# Altium schematic sheet STM32H745 - Copy.SchDoc
size A
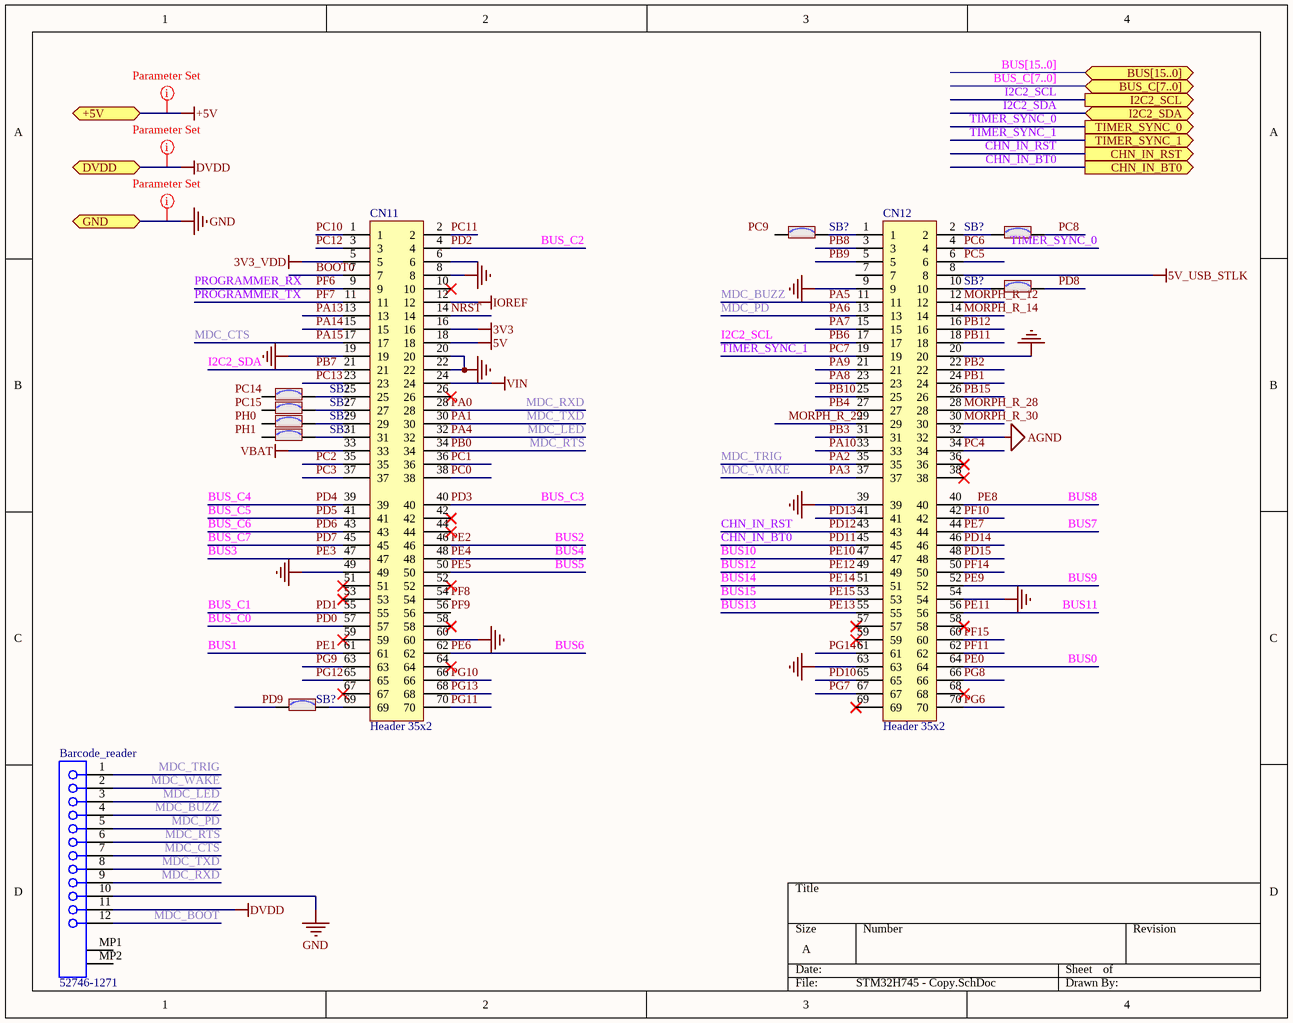
[diagram p0: STM32H745 - Copy.SchDoc]

## Parts
(Parts that share a designator on the sheet are numbered #1, #2 ... from top to bottom, then left to right.)
Barcode_reader  52746-1271  [MOLX-52746-1271]
CN11  Header 35x2  [CON_SAMTEC_TSW-135-07-X-D]
CN12  Header 35x2  [CON_SAMTEC_TSW-135-07-X-D]
SB?#1  SB_ON  [SOLDER-BRIDGE_R0603-0R]  (value not drawn)
SB?#2  SB_ON  [SOLDER-BRIDGE_R0603-0R]  (value not drawn)
SB?#3  SB_ON  [SOLDER-BRIDGE_R0603-0R]  (value not drawn)
SB?#4  SB_ON  [SOLDER-BRIDGE_R0603-0R]  (value not drawn)
SB?#5  SB_ON  [SOLDER-BRIDGE_R0603-0R]  (value not drawn)
SB?#6  SB_ON  [SOLDER-BRIDGE_R0603-0R]  (value not drawn)
SB?#7  SB_ON  [SOLDER-BRIDGE_R0603-0R]  (value not drawn)
SB?#8  SB_ON  [SOLDER-BRIDGE_R0603-0R]  (value not drawn)

## Ports
+5V (bidir), BUS[15..0] (bidir), BUS_C[7..0] (bidir), CHN_IN_BT0 (out), CHN_IN_RST (out), DVDD (bidir), GND (bidir), I2C2_SCL (out), I2C2_SDA (bidir), TIMER_SYNC_0 (out), TIMER_SYNC_1 (out)

## Nets
3V3: CN11.16
3V3_VDD: CN11.5
5V: CN11.18
5V_USB_STLK: CN12.8
+5V: port +5V
AGND: CN12.32
DVDD: Barcode_reader.11 ; port DVDD
GND: Barcode_reader.10 CN11.8 CN11.19 CN11.20 CN11.22 CN11.49 CN11.60 CN12.9 CN12.20 CN12.39 CN12.54 CN12.63 ; port GND
IOREF: CN11.12
VBAT: CN11.33
VIN: CN11.24
BOOT0: CN11.7
BUS0: CN12.64  [also labelled PE0]
BUS1: CN11.61  [also labelled PE1]
BUS2: CN11.46  [also labelled PE2]
BUS3: CN11.47  [also labelled PE3]
BUS4: CN11.48  [also labelled PE4]
BUS5: CN11.50  [also labelled PE5]
BUS6: CN11.62  [also labelled PE6]
BUS7: CN12.44  [also labelled PE7]
BUS8: CN12.40  [also labelled PE8]
BUS9: CN12.52  [also labelled PE9]
BUS10: CN12.47  [also labelled PE10]
BUS11: CN12.56  [also labelled PE11]
BUS12: CN12.49  [also labelled PE12]
BUS13: CN12.55  [also labelled PE13]
BUS14: CN12.51  [also labelled PE14]
BUS15: CN12.53  [also labelled PE15]
BUS_C0: CN11.57  [also labelled PD0]
BUS_C1: CN11.55  [also labelled PD1]
BUS_C2: CN11.4  [also labelled PD2]
BUS_C3: CN11.40  [also labelled PD3]
BUS_C4: CN11.39  [also labelled PD4]
BUS_C5: CN11.41  [also labelled PD5]
BUS_C6: CN11.43  [also labelled PD6]
BUS_C7: CN11.45  [also labelled PD7]
CHN_IN_BT0: CN12.45 ; port CHN_IN_BT0  [also labelled PD11]
CHN_IN_RST: CN12.43 ; port CHN_IN_RST  [also labelled PD12]
I2C2_SCL: CN12.17 ; port I2C2_SCL  [also labelled PB6]
I2C2_SDA: CN11.21 ; port I2C2_SDA  [also labelled PB7]
MDC_BOOT: Barcode_reader.12
MDC_BUZZ: Barcode_reader.4 CN12.11  [also labelled PA5]
MDC_CTS: Barcode_reader.7 CN11.17  [also labelled PA15]
MDC_LED: Barcode_reader.3 CN11.32  [also labelled PA4]
MDC_PD: Barcode_reader.5 CN12.13  [also labelled PA6]
MDC_RTS: Barcode_reader.6 CN11.34  [also labelled PB0]
MDC_RXD: Barcode_reader.9 CN11.28  [also labelled PA0]
MDC_TRIG: Barcode_reader.1 CN12.35  [also labelled PA2]
MDC_TXD: Barcode_reader.8 CN11.30  [also labelled PA1]
MDC_WAKE: Barcode_reader.2 CN12.37  [also labelled PA3]
MORPH_R_12: CN12.12
MORPH_R_14: CN12.14
MORPH_R_28: CN12.28
MORPH_R_29: CN12.29
MORPH_R_30: CN12.30
NRST: CN11.14
PA7: CN12.15
PA8: CN12.23
PA9: CN12.21
PA10: CN12.33
PA13: CN11.13
PA14: CN11.15
PB1: CN12.24
PB2: CN12.22
PB3: CN12.31
PB4: CN12.27
PB8: CN12.3
PB9: CN12.5
PB10: CN12.25
PB11: CN12.18
PB12: CN12.16
PB15: CN12.26
PC0: CN11.38
PC1: CN11.36
PC2: CN11.35
PC3: CN11.37
PC4: CN12.34
PC5: CN12.6
PC6: CN12.4 ; port TIMER_SYNC_0  [also labelled TIMER_SYNC_0]
PC7: CN12.19 ; port TIMER_SYNC_1  [also labelled TIMER_SYNC_1]
PC8: SB?#2.2
PC10: CN11.1
PC11: CN11.2
PC12: CN11.3
PC13: CN11.23
PD8: SB?#3.2
PD9: SB?#8.1
PD10: CN12.65
PD13: CN12.41
PD14: CN12.46
PD15: CN12.48
PF6: CN11.9  [also labelled PROGRAMMER_RX]
PF7: CN11.11  [also labelled PROGRAMMER_TX]
PF8: CN11.54
PF9: CN11.56
PF10: CN12.42
PF11: CN12.62
PF14: CN12.50
PF15: CN12.60
PG6: CN12.70
PG7: CN12.67
PG8: CN12.66
PG9: CN11.63
PG10: CN11.66
PG11: CN11.70
PG12: CN11.65
PG13: CN11.68
PG14: CN12.61
NetCN11_25: CN11.25 SB?#4.2
NetCN11_27: CN11.27 SB?#5.2
NetCN11_29: CN11.29 SB?#6.2
NetCN11_31: CN11.31 SB?#7.2
NetCN11_69: CN11.69 SB?#8.2
NetCN12_1: CN12.1 SB?#1.2
NetCN12_2: CN12.2 SB?#2.1
NetCN12_10: CN12.10 SB?#3.1

Not connected (* = marked no-connect by the designer): Barcode_reader MP1 MP2; CN11 6 10* 26* 42* 44* 51* 52* 53* 58* 59* 64* 67*; CN12 7 36* 38* 57* 58* 59* 68* 69*; SB?#1 1; SB?#4 1; SB?#5 1; SB?#6 1; SB?#7 1

## Buses and harness runs
bus BUS[15..0] = port BUS[15..0]
bus BUS_C[7..0] = port BUS_C[7..0]

## Layout directives
net class Power: +5V, DVDD, GND

## Notes on the sheet
- Labels drawn without touching a wire or pin: PC9, PC14, PC15, PH0, PH1

## Library data of the parts
Barcode_reader = CMP-1241-00374-1: 0.5 mm Pitch Easy-On(TM) Type FPC Connector, 2.0 mm Mated Height, Right Angle, ZIF, SMT, Bottom Contact, 12 Circuits, -20 to 85 degC, ELV and RoHS Compliant, Tape and Reel; Manufacturer: Molex; Pitch - Mating Interface: 0.50mm; PCB Retention: Yes; Current (Max per Contact): 0.5A; Material - Metal: Phosphor Bronze; Entry Angle: 90degrees Angle; Durability (mating cycles max): 20; Mated Height: 2.00mm; Circuits (Loaded): 12; Material - Plating Termination: Gold; Stackable: No; Voltage (Max): 50V; PackageReference: 52746-1271; Polarized to PCB: Yes; ComponentLink1Description: Manufacturer URL; ComponentLink1URL: http://www.molex.com/molex/index.jsp; ComponentLink2URL: http://www.molex.com/webdocs/datasheets/pdf/en-us/0527461271_FFC_FPC_CONNECTORS.pdf; Mounting Technology: Surface Mount; Orientation: Right Angle; Packing: Tape and Reel; ComponentLink3Description: Package Specification; ComponentLink3URL: http://www.molex.com/pdm_docs/sd/527461271_sd.pdf; Number of Rows: 1; Contact Position: Bottom; PackageVersion: Rev. H, 05/2009; RoHS: TRUE; Material - Plating Mating: Gold; PartNumber: 52746-1271; ComponentLink2Description: Datasheet; PCB Locator: No; PackageDescription: 12-Lead FPC Connector, Pitch 0.5 mm
CN11 CN12 = MCD-01210: Header, 35x2, 2,54mm, VR, TH, Height 5.84mm/2.54mm
SB?#1-SB?#8 = MCD-00071: Solder Bridge ON; Part_Type: Mechanical; Manufacturer_Part_Number: RC0603JR-070RL; Manufacturer: YAGEO; Provided_By: SUBCO; Internal_Part_Number: MCD-00071; Status: Released; ComponentLink1Description: Datasheet; Package: SB0603; ComponentLink1URL: http://tunmcdsvn.tun.st.com/Component_Datasheet_Library/Trunk/Resistors/Yageo_Resistor_RC0603-series; ECCN_US: n/a; ECCN_EU: n/a